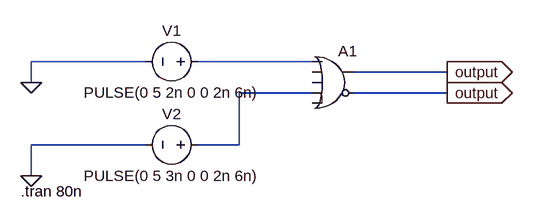
[diagram p0: schematic latch.asc]
latch.asc, the LTspice schematic file:
Version 4.1
SHEET 1 880 680
WIRE -112 96 -288 96
WIRE 144 96 -32 96
WIRE 352 112 208 112
WIRE -288 128 -288 96
WIRE 144 144 32 144
WIRE 352 144 208 144
WIRE -112 224 -288 224
WIRE 32 224 32 144
WIRE 32 224 -32 224
WIRE -288 272 -288 224
FLAG -288 128 0
FLAG -288 272 0
FLAG 352 144 output
IOPIN 352 144 Out
FLAG 352 112 output
IOPIN 352 112 Out
SYMBOL Digital\\or 176 64 R0
SYMATTR InstName A1
SYMBOL voltage -16 96 R90
WINDOW 0 -32 56 VBottom 2
WINDOW 3 32 56 VTop 2
WINDOW 123 0 0 Left 0
WINDOW 39 0 0 Left 0
SYMATTR InstName V1
SYMATTR Value PULSE(0 5 2n 0 0 2n 6n)
SYMBOL voltage -16 224 R90
WINDOW 0 -32 56 VBottom 2
WINDOW 3 32 56 VTop 2
WINDOW 123 0 0 Left 0
WINDOW 39 0 0 Left 0
SYMATTR InstName V2
SYMATTR Value PULSE(0 5 3n 0 0 2n 6n)
TEXT -304 296 Left 2 !.tran 80n

The netlist it stands for:
* latch.asc
A1 N001 0 0 N002 0 output output 0 OR
V1 N001 0 PULSE(0 5 2n 0 0 2n 6n)
V2 N002 0 PULSE(0 5 3n 0 0 2n 6n)
.tran 80n
.backanno
.end